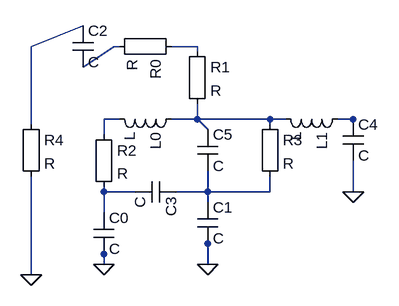
[diagram p0: schematic out.asc]
out.asc, the LTspice schematic file:
Version 4
SHEET 1 1000 1000
SYMBOL Misc\EuropeanResistor 312 16 R90
SYMATTR InstName R0
WIRE 216 32 208 32
WIRE 296 32 336 32
SYMBOL Misc\EuropeanResistor 320 24 R0
SYMATTR InstName R1
WIRE 336 40 336 32
WIRE 336 120 336 144
SYMBOL ind 312 128 R90
SYMATTR InstName L0
WIRE 216 144 192 144
WIRE 296 144 336 144
SYMBOL Misc\EuropeanResistor 176 152 R0
SYMATTR InstName R2
WIRE 192 168 192 144
WIRE 192 248 192 256
SYMBOL cap 176 288 R0
SYMATTR InstName C0
WIRE 192 288 192 256
WIRE 192 352 192 344
SYMBOL ind 568 128 R90
SYMATTR InstName L1
WIRE 472 144 448 144
WIRE 552 144 576 144
SYMBOL Misc\EuropeanResistor 432 136 R0
SYMATTR InstName R3
WIRE 448 152 448 144
WIRE 448 232 448 256
SYMBOL cap 336 272 R0
SYMATTR InstName C1
WIRE 352 272 352 256
WIRE 352 336 352 336
SYMBOL cap 144 0 R0
SYMATTR InstName C2
WIRE 160 0 80 32
WIRE 160 64 208 32
FLAG 192 368 0
WIRE 192 368 192 344
FLAG 352 368 0
WIRE 352 368 352 336
FLAG 80 384 0
WIRE 80 384 80 288
FLAG 576 256 0
WIRE 576 256 576 216
SYMBOL cap 304 240 R90
SYMATTR InstName C3
WIRE 240 256 192 256
WIRE 304 256 352 256
SYMBOL cap 560 144 R0
SYMATTR InstName C4
WIRE 576 144 576 144
WIRE 576 208 576 216
SYMBOL cap 336 160 R0
SYMATTR InstName C5
WIRE 352 160 336 144
WIRE 352 224 352 256
SYMBOL Misc\EuropeanResistor 64 136 R0
SYMATTR InstName R4
WIRE 80 152 80 32
WIRE 80 232 80 288
WIRE 448 144 336 144
WIRE 448 256 352 256

The netlist it stands for:
* out.asc
R0 N002 N001 R
R1 N002 N003 R
L0 N003 N004 L
R2 N004 N005 R
C0 N005 0 C
L1 N006 N003 L
R3 N003 N007 R
C1 N007 0 C
C2 N008 N001 C
C3 N007 N005 C
C4 N006 0 C
C5 N003 N007 C
R4 N008 0 R
.backanno
.end